# EAGLE schematic Micro RC Receiver (EAGLE 7.6.0)
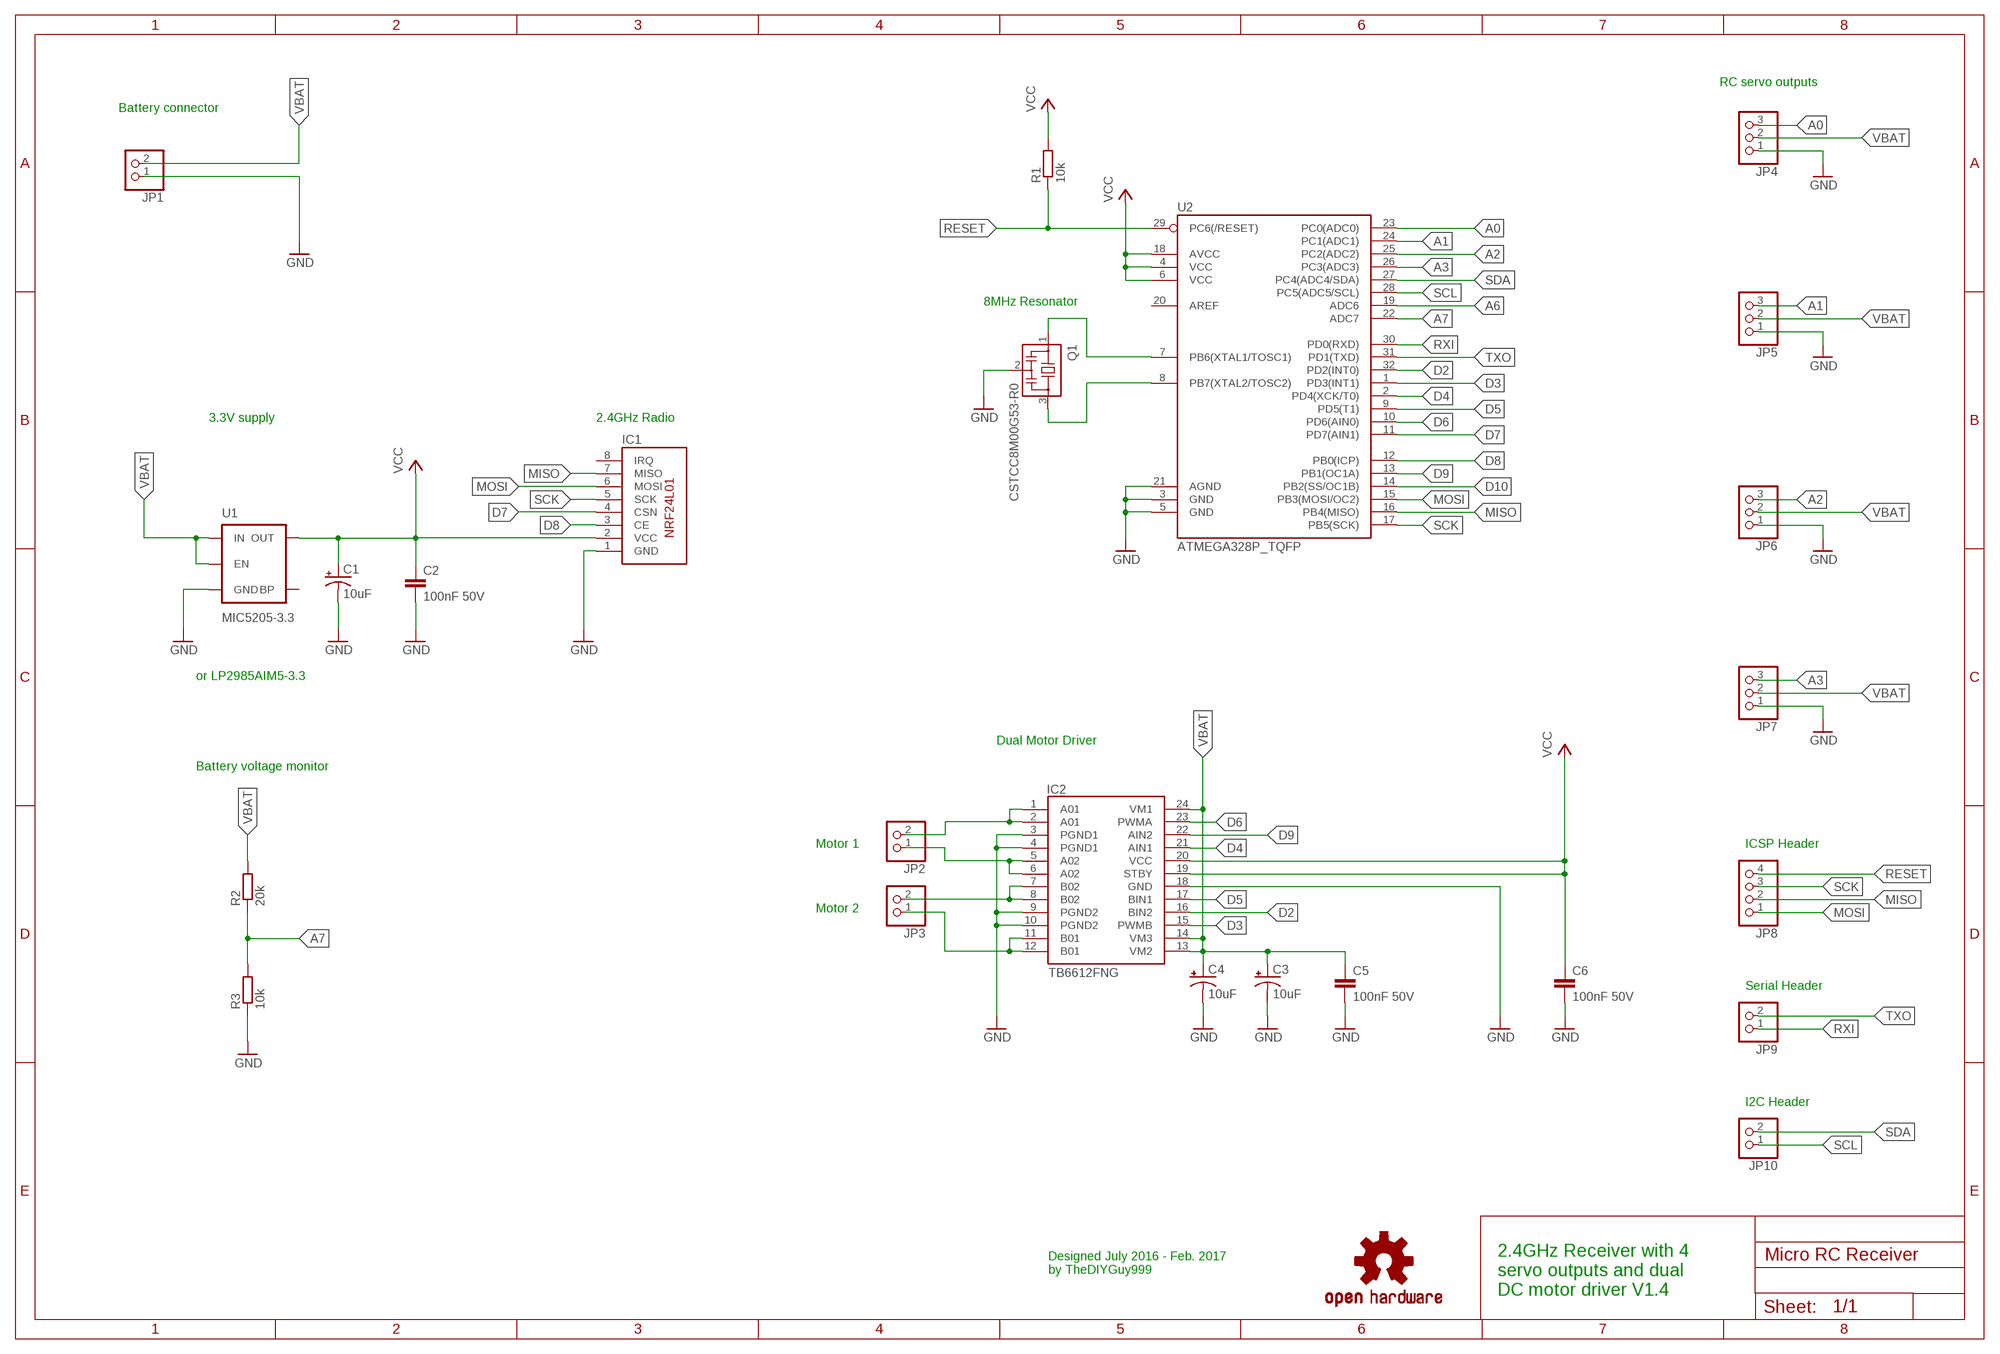
[diagram p0: schematic, sheet 1]

## Parts
C1  10uF  10UF-16V-10%(TANT)  [EIA3216]
C2  100nF 50V  C-EUC0805  [C0805]
C3  10uF  10UF-16V-10%(TANT)  [EIA3216]
C4  10uF  10UF-16V-10%(TANT)  [EIA3216]
C5  100nF 50V  C-EUC0805  [C0805]
C6  100nF 50V  C-EUC0805  [C0805]
IC1  NRF24L01SMD  [NRF24L01_SMD]
IC2  TB6612FNG  [SSOP24]
JP1  PINHD-1X2  [1X02]
JP2  PINHD-1X2  [1X02]
JP3  PINHD-1X2  [1X02]
JP4  PINHD-1X3  [1X03]
JP5  PINHD-1X3  [1X03]
JP6  PINHD-1X3  [1X03]
JP7  PINHD-1X3  [1X03]
JP8  PINHD-1X4  [1X04]
JP9  PINHD-1X2  [1X02]
JP10  PINHD-1X2  [1X02]
LOGO1  OSHW-LOGOS  [OSHW-LOGO-S]
Q1  CSTCC8M00G53-R0  [CSTCC]
R1  10k  R-EU_R0805  [R0805]
R2  20k  R-EU_R0805  [R0805]
R3  10k  R-EU_R0805  [R0805]
U1  MIC5205-3.3  MIC52053.3V  [SOT23-5]
U2  ATMEGA328P_TQFP  [TQFP32-08]

## Nets
A0: JP4.3 U2.23(PC0(ADC0))
A1: JP5.3 U2.24(PC1(ADC1))
A2: JP6.3 U2.25(PC2(ADC2))
A3: JP7.3 U2.26(PC3(ADC3))
A6: U2.19(ADC6)
A7: R2.1 R3.2 U2.22(ADC7)
D2: IC2.16(BIN2) U2.32(PD2(INT0))
D3: IC2.15(PWMB) U2.1(PD3(INT1))
D4: IC2.21(AIN1) U2.2(PD4(XCK/T0))
D5: IC2.17(BIN1) U2.9(PD5(T1))
D6: IC2.23(PWMA) U2.10(PD6(AIN0))
D7: IC1.4(CSN) U2.11(PD7(AIN1))
D8: IC1.3(CE) U2.12(PB0(ICP))
D9: IC2.22(AIN2) U2.13(PB1(OC1A))
D10: U2.14(PB2(SS/OC1B))
GND: C1.C(-) C2.2 C3.C(-) C4.C(-) C5.2 C6.2 IC1.1(GND) IC2.3(PGND1) IC2.4(PGND1) IC2.9(PGND2) IC2.10(PGND2) IC2.18(GND) JP1.1 JP4.1 JP5.1 JP6.1 JP7.1 Q1.2 R3.1 U1.2(GND) U2.3(GND) U2.5(GND) U2.21(AGND)
MISO: IC1.7(MISO) JP8.2 U2.16(PB4(MISO))
MOSI: IC1.6(MOSI) JP8.1 U2.15(PB3(MOSI/OC2))
N$1: Q1.3 U2.8(PB7(XTAL2/TOSC2))
N$2: Q1.1 U2.7(PB6(XTAL1/TOSC1))
N$4: IC2.11(B01) IC2.12(B01) JP3.1
N$5: IC2.7(B02) IC2.8(B02) JP3.2
N$6: IC2.5(A02) IC2.6(A02) JP2.1
N$7: IC2.1(A01) IC2.2(A01) JP2.2
RESET: JP8.4 R1.1 U2.29(PC6(/RESET))
RXI: JP9.1 U2.30(PD0(RXD))
SCK: IC1.5(SCK) JP8.3 U2.17(PB5(SCK))
SCL: JP10.1 U2.28(PC5(ADC5/SCL))
SDA: JP10.2 U2.27(PC4(ADC4/SDA))
TXO: JP9.2 U2.31(PD1(TXD))
VBAT: C3.A(+) C4.A(+) C5.1 IC2.13(VM2) IC2.14(VM3) IC2.24(VM1) JP1.2 JP4.2 JP5.2 JP6.2 JP7.2 R2.2 U1.1(IN) U1.3(EN)
VCC: C1.A(+) C2.1 C6.1 IC1.2(VCC) IC2.19(STBY) IC2.20(VCC) R1.2 U1.5(OUT) U2.4(VCC) U2.6(VCC) U2.18(AVCC)
Unconnected: IC1.8(IRQ) U1.4(BP) U2.20(AREF)

## Notes on the sheet
- RC servo outputs
- Battery connector
- 8MHz Resonator
- 3.3V supply | 2.4GHz Radio
- or LP2985AIM5-3.3
- Dual Motor Driver
- Battery voltage monitor
- Motor 1 | ICSP Header
- Motor 2
- Serial Header
- I2C Header
- Designed July 2016 - Feb. 2017
  by TheDIYGuy999
- 2.4GHz Receiver with 4
  servo outputs and dual
  DC motor driver V1.4

## Library data of the parts
C1 C3 C4 = SparkFun-Capacitors:10UF-16V-10%(TANT): CAP-00811 1206/EIA-3216 Tantalum capacitor; PROD_ID: CAP-00811
C2 C5 C6 = rcl:C-EU: CAPACITOR, European symbol
IC1 = 00_custom:NRF24L01: 2.4GHz Radio Module
IC2 = 00_custom:TB6612FNG
JP1-JP3 JP9 JP10 = 00_custom_pinhead:PINHD-1X2: PIN HEADER
JP4-JP7 = 00_custom_pinhead:PINHD-1X3: PIN HEADER
JP8 = 00_custom_pinhead:PINHD-1X4: PIN HEADER
LOGO1 = SparkFun-Aesthetics:OSHW-LOGO: Open Source Hardware Logo This logo indicates the piece of hardware it is found on incorporates a OSHW license and/or adheres to the definition of open source hardware found here: http://freedomdefined.org/OSHW
Q1 = 00_custom:CSTCC: Resonator Source: murata.co.jp; DISTRELEC: 174-62-633
R1-R3 = rcl:R-EU_: RESISTOR, European symbol
U1 = SparkFun-PowerIC:MIC5205: MIC5205 150mA vreg 3.3V - VREG-00822 5V - VREG-00823; PROD_ID: VREG-00822
U2 = SparkFun-DigitalIC:ATMEGA328P_TQFP; PROD_ID: IC-09069